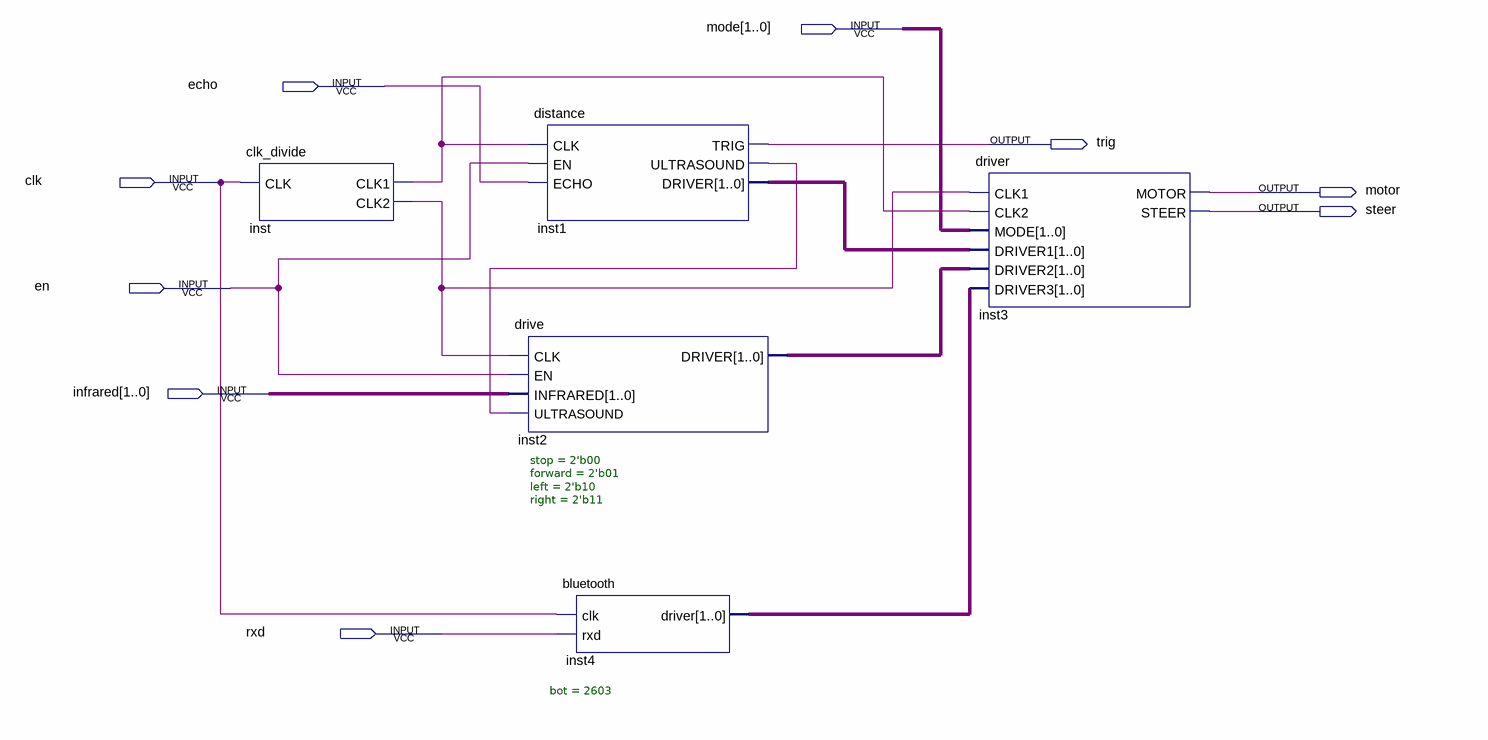
[diagram p0: schematic sheet]
// Quartus schematic car.bdf as structural Verilog: 5 symbols, 9 pins
module car (
  input  [1:0] mode,
  input  echo,
  input  clk,
  input  en,
  input  [1:0] infrared,
  input  rxd,
  output trig,
  output motor,
  output steer
);

  wire inst1_ultrasound, inst_clk1, inst_clk2;
  wire [1:0] inst1_driver, inst2_driver, inst4_driver;

  clk_divide inst (.CLK(clk), .CLK1(inst_clk1), .CLK2(inst_clk2));
  distance inst1 (
    .CLK(inst_clk1), .EN(en), .ECHO(echo), .TRIG(trig), .ULTRASOUND(inst1_ultrasound), .DRIVER(inst1_driver));
  drive #(.stop(2'b00), .forward(2'b01), .left(2'b10), .right(2'b11)) inst2 (
    .CLK(inst_clk2), .EN(en), .INFRARED(infrared), .ULTRASOUND(inst1_ultrasound), .DRIVER(inst2_driver));
  bluetooth #(.bot(2603)) inst4 (.clk(clk), .rxd(rxd), .driver(inst4_driver));
  driver inst3 (
    .CLK1(inst_clk2), .CLK2(inst_clk1), .MODE(mode), .DRIVER1(inst1_driver), .DRIVER2(inst2_driver),
    .DRIVER3(inst4_driver), .MOTOR(motor), .STEER(steer));
endmodule
